# Altium schematic sheet Sch_Control.SchDoc
size A4; Organization: ORGANIZATION; Address1: ADDRESS 1; Address2: ADDRESS 2; Address3: ADDRESS 3; Address4: ADDRESS 4; Revision: 1; SheetNumber: 1; SheetTotal: 1; ENG_APP_DATE: --/--/--; DSN_APP_DATE: --/--/--; CHK_APP_DATE: --/--/--; Engineer1: Renan Duarte
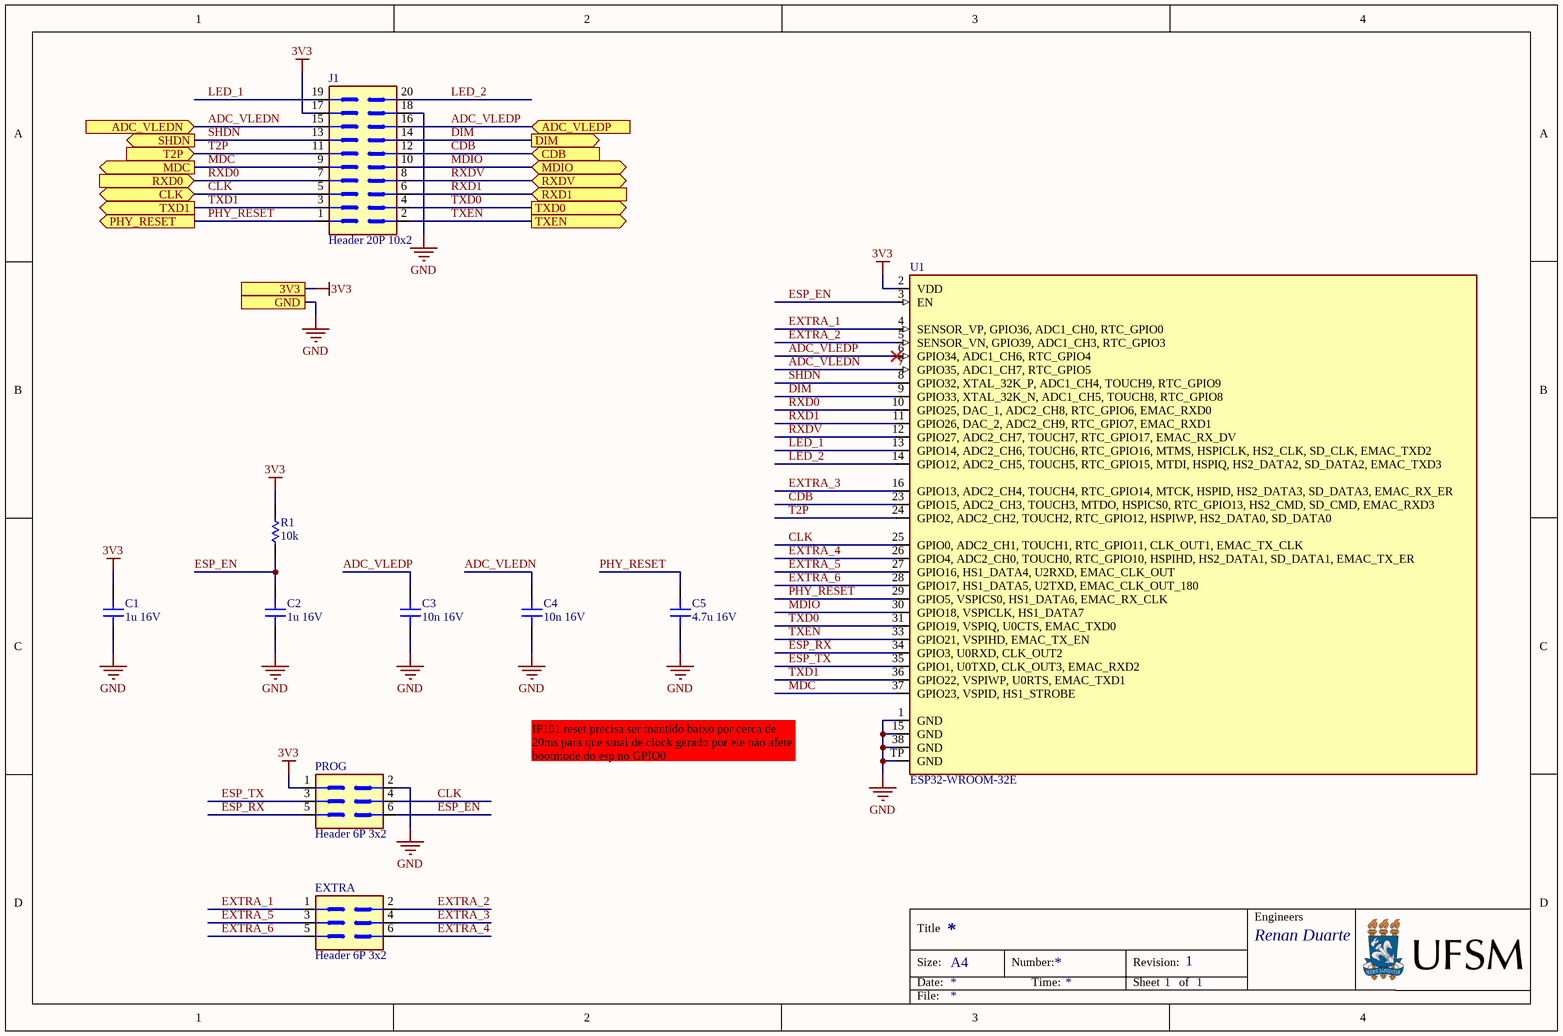
[diagram p0: Sch_Control.SchDoc]

## Parts
C1  1u 16V  [CAP_SMD_0603]
C2  1u 16V  [CAP_SMD_0603]
C3  10n 16V  [CAP_SMD_0603]
C4  10n 16V  [CAP_SMD_0603]
C5  4.7u 16V  [CAP_SMD_0603]
EXTRA  Header 6P 3x2  [CON_PTH_6P_HEADER_3x2_2.54mm]  (no BOM)
J1  Header 20P 10x2  [CON_PTH_20P_HEADER_10x2_2.54mm]
PROG  Header 6P 3x2  [CON_PTH_6P_HEADER_3x2_2.54mm]  (no BOM)
R1  10k  [RES_SMD_0603]
U1  ESP32-WROOM-32E  [IC_ESP32-WROOM-32UE-H4]

## Ports
3V3, ADC_VLEDN (in), ADC_VLEDP (in), CDB (in), CLK (bidir), DIM (out), GND, MDC (out), MDIO (bidir), PHY_RESET (out), RXD0 (in), RXD1 (in), RXDV (bidir), SHDN (out), T2P (in), TXD0 (out), TXD1 (out), TXEN (out)

## Nets
3V3: C1.1 J1.17 PROG.1 R1.1 U1.2(VDD) ; port 3V3
GND: C1.2 C2.2 C3.2 C4.2 C5.2 J1.18 PROG.2 U1.1(GND) U1.15(GND) U1.38(GND) U1.TP(GND) ; port GND
ADC_VLEDN: C4.1 J1.15 U1.7(GPIO35,_ADC1_CH7,_RTC_GPIO5) ; port ADC_VLEDN
ADC_VLEDP: C3.1 J1.16 U1.6(GPIO34,_ADC1_CH6,_RTC_GPIO4) ; port ADC_VLEDP
CDB: J1.12 U1.23(GPIO15,_ADC2_CH3,_TOUCH3,_MTDO,_HSPICS0,_RTC_GPIO13,_HS2_CMD,_SD_CMD,_EMAC_RXD3) ; port CDB
CLK: J1.5 PROG.4 U1.25(GPIO0,_ADC2_CH1,_TOUCH1,_RTC_GPIO11,_CLK_OUT1,_EMAC_TX_CLK) ; port CLK
DIM: J1.14 U1.9(GPIO33,_XTAL_32K_N,_ADC1_CH5,_TOUCH8,_RTC_GPIO8) ; port DIM
ESP_EN: C2.1 PROG.6 R1.2 U1.3(EN)
ESP_RX: PROG.5 U1.34(GPIO3,_U0RXD,_CLK_OUT2)
ESP_TX: PROG.3 U1.35(GPIO1,_U0TXD,_CLK_OUT3,_EMAC_RXD2)
EXTRA_1: EXTRA.1 U1.4(SENSOR_VP,_GPIO36,_ADC1_CH0,_RTC_GPIO0)
EXTRA_2: EXTRA.2 U1.5(SENSOR_VN,_GPIO39,_ADC1_CH3,_RTC_GPIO3)
EXTRA_3: EXTRA.4 U1.16(GPIO13,_ADC2_CH4,_TOUCH4,_RTC_GPIO14,_MTCK,_HSPID,_HS2_DATA3,_SD_DATA3,_EMAC_RX_ER)
EXTRA_4: EXTRA.6 U1.26(GPIO4,_ADC2_CH0,_TOUCH0,_RTC_GPIO10,_HSPIHD,_HS2_DATA1,_SD_DATA1,_EMAC_TX_ER)
EXTRA_5: EXTRA.3 U1.27(GPIO16,_HS1_DATA4,_U2RXD,_EMAC_CLK_OUT)
EXTRA_6: EXTRA.5 U1.28(GPIO17,_HS1_DATA5,_U2TXD,_EMAC_CLK_OUT_180)
LED_1: J1.19 U1.13(GPIO14,_ADC2_CH6,_TOUCH6,_RTC_GPIO16,_MTMS,_HSPICLK,_HS2_CLK,_SD_CLK,_EMAC_TXD2)
LED_2: J1.20 U1.14(GPIO12,_ADC2_CH5,_TOUCH5,_RTC_GPIO15,_MTDI,_HSPIQ,_HS2_DATA2,_SD_DATA2,_EMAC_TXD3)
MDC: J1.9 U1.37(GPIO23,_VSPID,_HS1_STROBE) ; port MDC
MDIO: J1.10 U1.30(GPIO18,_VSPICLK,_HS1_DATA7) ; port MDIO
PHY_RESET: C5.1 J1.1 U1.29(GPIO5,_VSPICS0,_HS1_DATA6,_EMAC_RX_CLK) ; port PHY_RESET
RXD0: J1.7 U1.10(GPIO25,_DAC_1,_ADC2_CH8,_RTC_GPIO6,_EMAC_RXD0) ; port RXD0
RXD1: J1.6 U1.11(GPIO26,_DAC_2,_ADC2_CH9,_RTC_GPIO7,_EMAC_RXD1) ; port RXD1
RXDV: J1.8 U1.12(GPIO27,_ADC2_CH7,_TOUCH7,_RTC_GPIO17,_EMAC_RX_DV) ; port RXDV
SHDN: J1.13 U1.8(GPIO32,_XTAL_32K_P,_ADC1_CH4,_TOUCH9,_RTC_GPIO9) ; port SHDN
T2P: J1.11 U1.24(GPIO2,_ADC2_CH2,_TOUCH2,_RTC_GPIO12,_HSPIWP,_HS2_DATA0,_SD_DATA0) ; port T2P
TXD0: J1.4 U1.31(GPIO19,_VSPIQ,_U0CTS,_EMAC_TXD0) ; port TXD0
TXD1: J1.3 U1.36(GPIO22,_VSPIWP,_U0RTS,_EMAC_TXD1) ; port TXD1
TXEN: J1.2 U1.33(GPIO21,_VSPIHD,_EMAC_TX_EN) ; port TXEN

## Notes on the sheet
- IP101 reset precisa ser mantido baixo por cerca de 20ms para que sinal de clock gerado por ele não afete bootmode do esp no GPIO0
- Engineers
- Title
- Size:
- Date:
- A4
- Number:
- Time:
- Revision:
- Sheet
- of
- File:

## Library data of the parts
C1-C5 = CAP_SMD: Capacitor SMD - Generic
EXTRA PROG = CON_PTH_HEADER_6P_3x2: 3x2 6P PTH pin header - Generic
J1 = CON_PTH_HEADER_20P_10x2: 10x2 20P PTH pin header - Generic
R1 = RES_SMD: Resistor SMD - Generic
U1 = MODULE_ESP32-WROOM-32E: RX TXRX MOD WIFI TRACE ANT SMD; MF: Espressif Systems; Package: SMD-44 Espressif Systems; Value: *; MP: ESP32-WROOM-32E; Datasheet: https://datasheet.octopart.com/ESP32-WROOM-32E-%284MB%29-Espressif-Systems-datasheet-151884363.pd